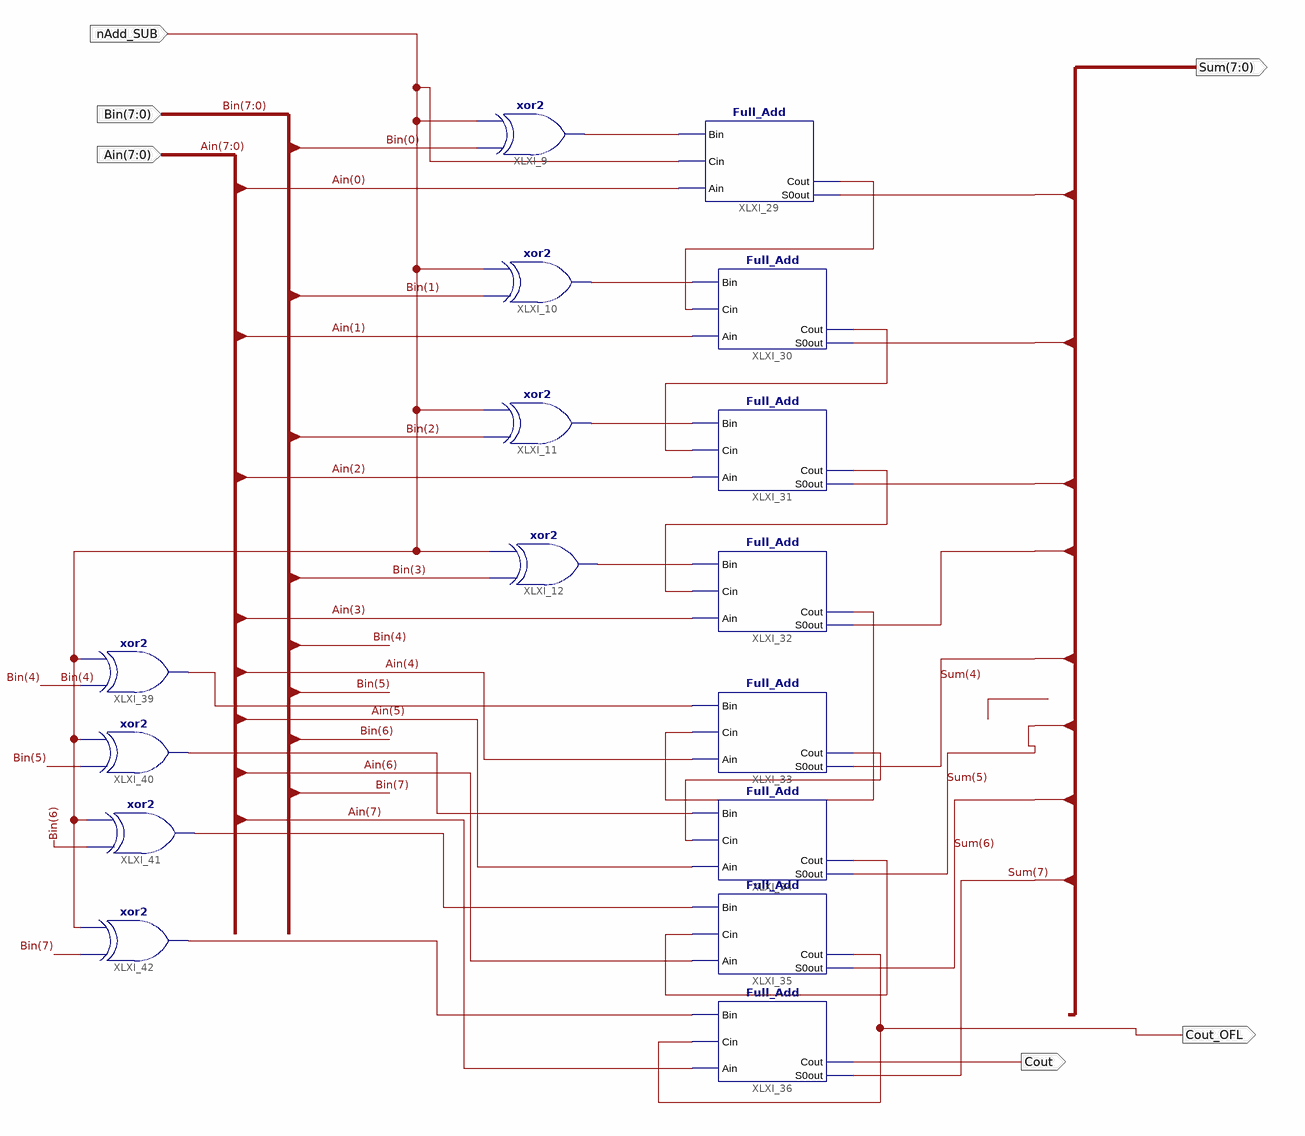
[diagram p0: schematic sheet 1]
// Xilinx ISE schematic addersub8.sch (spartan3e) as structural Verilog: 16 symbols, 6 ports
module addersub8 (
  input  [7:0] Ain,
  input  [7:0] Bin,
  input  nAdd_SUB,
  output [7:0] Sum,
  output Cout,
  output Cout_OFL
);

  wire XLXN_14, XLXN_15, XLXN_21, XLXN_51, XLXN_56, XLXN_57, XLXN_61, XLXN_120, XLXN_124, XLXN_130, XLXN_153,
       XLXN_154, XLXN_155, XLXN_156;

  xor XLXI_9 (XLXN_56, Bin[0], nAdd_SUB);
  xor XLXI_10 (XLXN_51, Bin[1], nAdd_SUB);
  xor XLXI_11 (XLXN_57, Bin[2], nAdd_SUB);
  xor XLXI_12 (XLXN_61, Bin[3], nAdd_SUB);
  Full_Add XLXI_29 (.Bin(XLXN_56), .Cin(nAdd_SUB), .Ain(Ain[0]), .S0out(Sum[0]), .Cout(XLXN_14));
  Full_Add XLXI_30 (.Bin(XLXN_51), .Cin(XLXN_14), .Ain(Ain[1]), .S0out(Sum[1]), .Cout(XLXN_15));
  Full_Add XLXI_31 (.Bin(XLXN_57), .Cin(XLXN_15), .Ain(Ain[2]), .S0out(Sum[2]), .Cout(XLXN_21));
  Full_Add XLXI_32 (.Bin(XLXN_61), .Cin(XLXN_21), .Ain(Ain[3]), .S0out(Sum[3]), .Cout(XLXN_120));
  Full_Add XLXI_33 (.Bin(XLXN_153), .Cin(XLXN_120), .Ain(Ain[4]), .S0out(Sum[4]), .Cout(XLXN_124));
  Full_Add XLXI_36 (.Bin(XLXN_156), .Cin(Cout_OFL), .Ain(Ain[7]), .S0out(Sum[7]), .Cout(Cout));
  Full_Add XLXI_35 (.Bin(XLXN_155), .Cin(XLXN_130), .Ain(Ain[6]), .S0out(Sum[6]), .Cout(Cout_OFL));
  Full_Add XLXI_34 (.Bin(XLXN_154), .Cin(XLXN_124), .Ain(Ain[5]), .S0out(Sum[5]), .Cout(XLXN_130));
  xor XLXI_39 (XLXN_153, Bin[4], nAdd_SUB);
  xor XLXI_40 (XLXN_154, Bin[5], nAdd_SUB);
  xor XLXI_41 (XLXN_155, Bin[6], nAdd_SUB);
  xor XLXI_42 (XLXN_156, Bin[7], nAdd_SUB);
endmodule
